# Altium schematic sheet Power_Pos.SchDoc
size A4; CompanyName: TH Nürnberg; Address1: Kesslerplatz 12; Address2: 90489 Nürnberg; Address3: GERMANY; SheetNumber: 6; SheetTotal: 10
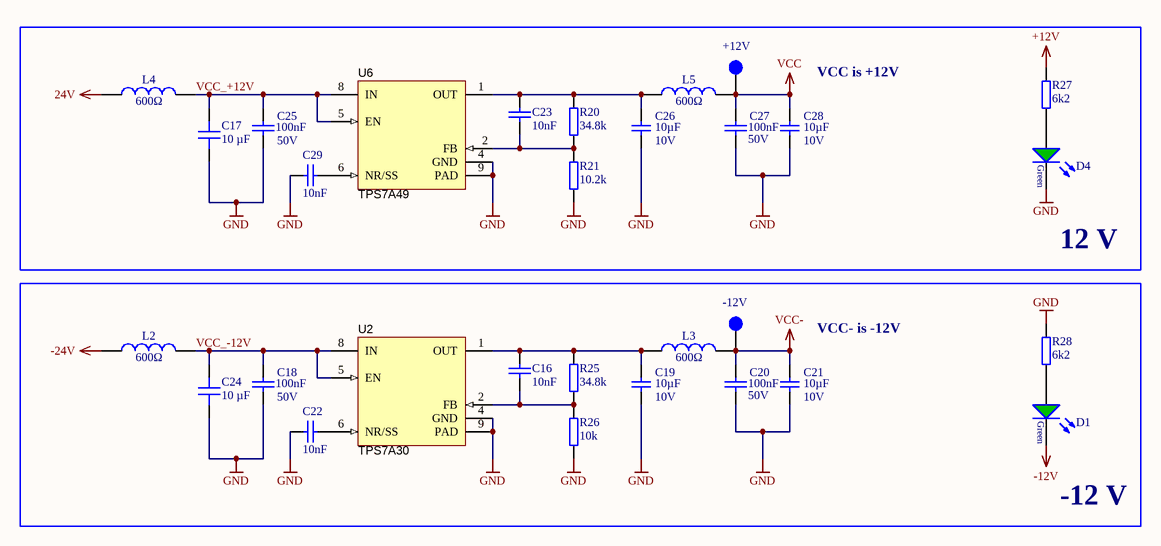
[diagram p0: Power_Pos.SchDoc]

## Parts
+12V  VCC  [TP_1mm]  (value not drawn)  (no BOM)
-12V  VCC  [TP_1mm]  (value not drawn)  (no BOM)
C16  10nF  [CAPC1608X07N]
C17  10 µF  [C_1206]
C18  100nF  Voltage: 50V  [CAPC1608X07N]
C19  10µF  Voltage: 10V  [C_1206]
C20  100nF  Voltage: 50V  [CAPC1608X07N]
C21  10µF  Voltage: 10V  [C_1206]
C22  10nF  [CAPC1608X07N]
C23  10nF  [CAPC1608X07N]
C24  10 µF  [C_1206]
C25  100nF  Voltage: 50V  [CAPC1608X07N]
C26  10µF  Voltage: 10V  [C_1206]
C27  100nF  Voltage: 50V  [CAPC1608X07N]
C28  10µF  Voltage: 10V  [C_1206]
C29  10nF  [CAPC1608X07N]
D1  150060GS75000  [WL-SMCW_0603]  (value not drawn)
D4  150060GS75000  [WL-SMCW_0603]  (value not drawn)
L2  600Ω  [WE-CBF_0805_High Current]
L3  600Ω  [WE-CBF_0805_High Current]
L4  600Ω  [WE-CBF_0805_High Current]
L5  600Ω  [WE-CBF_0805_High Current]
R20  34.8k  [RESC1608X06N]
R21  10.2k  [RESC1608X06N]
R25  34.8k  [RESC1608X06N]
R26  10k  [RESC1608X06N]
R27  6k2  [RES 0603_1608]
R28  6k2  [RES 0603_1608]
U2  TPS7A30  [DGN0008D_N]
U6  TPS7A49  [DGN0008D_N]

## Blocks framed on the sheet
12 V: +12V C17 C23 C25-C29 D4 L4 L5 R20 R21 R27 U6
-12 V: -12V C16 C18-C22 C24 D1 L2 L3 R25 R26 R28 U2

## Nets
24V: L4.1
+12V: R27.2
-12V: D1.1(K)
-24V: L2.1
GND: C17.1 C18.2 C19.1 C20.1 C21.1 C22.2 C24.1 C25.2 C26.1 C27.1 C28.1 C29.2 D4.1(K) R21.2 R26.2 R28.2 U2.4(GND) U2.9(PAD) U6.4(GND) U6.9(PAD)
VCC: +12V.1 C27.2 C28.2 L5.2
VCC-: -12V.1 C20.2 C21.2 L3.2
VCC_+12V: C17.2 C25.1 L4.2 U6.5(EN) U6.8(IN)
VCC_-12V: C18.1 C24.2 L2.2 U2.5(EN) U2.8(IN)
NetC16_1: C16.1 C19.2 L3.1 R25.1 U2.1(OUT)
NetC16_2: C16.2 R25.2 R26.1 U2.2(FB)
NetC22_1: C22.1 U2.6(NR/SS)
NetC23_1: C23.1 C26.2 L5.1 R20.1 U6.1(OUT)
NetC23_2: C23.2 R20.2 R21.1 U6.2(FB)
NetC29_1: C29.1 U6.6(NR/SS)
NetD1_2: D1.2(A) R28.1
NetD4_2: D4.2(A) R27.1

Not connected (* = marked no-connect by the designer): U2 3(NC) 7(DNC); U6 3(NC) 7(DNC)

## Notes on the sheet
- (near C28) VCC is +12V
- (near C21) VCC- is -12V
- Title
- Size:
- Date:
- A4
- Revision:
- Time:
- Sheet
- of
- Author:
- Project:

## Library data of the parts
+12V -12V = TP_1mm: Testpoint 1mm; Created: 2018_06_25_AGeiger; Value: Testpoint 1mm
C16 C22 C23 C29 = Cap_0603: MPN: 885012206065; MF: Würth Elektronik; Voltage: 25V; Dielectric: X7R; Value: 10nF; Supplier 1: Mouser; Supplier 2: Digi-Key; Supplier Part Number 1: 710-885012206065; Supplier Part Number 2: 732-7983-1-ND; Package: 0603
C17 C24 = CGA5L1X7R1H106K160AC: Capacitor 1206, 50 VDC, 10 µF, X7R; Manufacturer: TDK; Tolerance: 10 %; Voltage Rating: 50 VDC; Created from: MGremer; Manufacturer Part Number: CGA5L1X7R1H106K160AC; PartID: 25; Created On: 20.12.2020 13:54:13; ComponentLink1Description: Datasheet; ComponentLink1URL: https://product.tdk.com/info/en/catalog/datasheets/mlcc_automotive_general_en.pdf; Component Type: Capacitor 1206; Device Package: 1206; Last Updated: 20.12.2020 16:34:30; Mounting Type: SMD; Operating Temperature: -55 - 125°C; Series: CGA; Supplier 1: Mouser; Supplier Part Number 1: 810-CGA5L1X7R1H106K1; Type: Capacitor; Value: 10 µF; Live Cycle Status: 1; Stock number: Labor SMD Container
C18 C20 C25 C27 = Cap_0603: MPN: CC0603KRX7R9BB104; MF: Yageo; Tolerance: 10%; Dielectric: X5R; Value: 100nF; Supplier 1: Mouser; Supplier 2: Mouser; Supplier Part Number 1: 603-CC603KRX7R9BB104; Supplier Part Number 2: 710-885382206004; Package: 0603
C19 C21 C26 C28 = C_1206: Capacitor 1206; MPN: CL31A106KPHNNNE; Tolerance: 10%; MF: Samsung Electro-Mechanics; Dielectric: X5R; Package: 1206; Value: 10µF; Created: 2020_09_17_Liegmann; Supplier 1: Mouser; Supplier Part Number 1: 187-CL31A106KPHNNNE
D1 D4 = LED_Green_0603: WL-SMCW SMD Mono-color Chip LED Waterclear, size 0603, Green, 3.2 V, 140°; Forward Voltage: 3.2 V; Luminous Intensity: 430 mcd; Peak Wavelength: 515 nm; Dominant Wavelength: 520 nm; MF: Wuerth Elektronik; Published Date: Sep. 2017; ComponentLink1Description: Manufacturer; ComponentLink1URL: http://www.we-online.de; ComponentLink2Description: Datasheet; ComponentLink2URL: http://katalog.we-online.com/led/datasheet/150060GS75000.pdf; MPN: 150060GS75000; Size: 0603; Viewing Angle: 140°; Emitting Color: Green; Value: 150060GS75000; Package: 0603; Created: 2018_09_06_AGeiger; Supplier 1: Farnell; Supplier Part Number 1: 2322070; Supplier 2: Mouser; Supplier Part Number 2: 710-150060GS75000; Supplier 3: Digi-Key; Supplier Part Number 3: 732-4971-1-ND
L2-L5 = WE-CBF, 742792040: WE-CBF SMD EMI Suppression Ferrite Bead, 0805, 600Ω; MF: Würth Elektronik; Type: High Current; ComponentLink1Description: Manufacturer; ComponentLink1URL: http://www.we-online.de; ComponentLink2Description: Datasheet; ComponentLink2URL: http://katalog.we-online.de/pbs/datasheet/742792040.pdf; MPN: 742792040; Value: 600Ω; Size: 0805; Supplier 1: Farnell; Supplier 2: Mouser; Supplier 3: Digi-Key; Supplier Part Number 1: 1635735; Supplier Part Number 2: 710-742792040; Supplier Part Number 3: 732-1620-1-ND
R20 R25 = R_0603: MPN: CR0603-FX-3482ELF; MF: Bourns; Tolerance: 1%; Value: 34.8k; Supplier 1: Mouser; Supplier Part Number 1: 652-CR0603FX-3482ELF; Package: 0603
R21 = R_0603: MPN: CR0603-FX-1022ELF; MF: Bourns; Tolerance: 1%; Value: 10.2k; Supplier 1: Mouser; Supplier Part Number 1: 652-CR0603FX-1022ELF; Package: 0603
R26 = R_0603: MPN: CR0603-FX-1002ELF; MF: Bourns; Tolerance: 1%; Value: 10k; Supplier 1: Mouser; Supplier Part Number 1: 652-CR0603FX-1002ELF; Package: 0603
R27 R28 = RK73B1JTTD622J: SMD resistor E24 series; Manufacturer: KOA Speer; Tolerance: 5%; Created from: MGremer; Manufacturer Part Number: RK73B1JTTD622J; PartID: 93; Created On: 14.12.2020 16:17:14; ComponentLink1Description: Datasheet; ComponentLink1URL: https://www.mouser.de/datasheet/2/219/RK73B-1825463.pdf; Component Type: SMD resistor; Device Package: 0603; Last Updated: 02.03.2021 14:07:32; Mounting Type: SMD; Supplier 1: Mouser; Supplier Part Number 1: 660-RK73B1JTTD622J; Type: Resistor; Value: 6k2; Live Cycle Status: 1; Stock number: Labor SMD Container
U2 = TPS7A3001DGN: -36V, -200mA, Ultralow-Noise, High PSRR, Adjustable -1.18 to -33 V Output, Negative Linear Regulator, 8-pin MSOP (DGN), -40 to 125 degC, Green (RoHS & no Sb/Br); MF: Texas Instruments; Parameter 1: Farnell; PackageReference: DGN0008D; PackageDescription: 8-pin Plastic Small Outline, Body 3 x 3 mm, Pitch 0.65 mm; Supplier 1: Digi-Key; Supplier Part Number 1: 296-27750-1-ND; MPN: TPS7A3001DGN; ComponentLink1Description: Manufacturer URL; ComponentLink1URL: http://www.ti.com/; ComponentLink2Description: Datasheet; ComponentLink2URL: http://www.ti.com/general/docs/lit/getliterature.tsp?genericPartNumber=TPS7A3001&fileType=pdf; ComponentLink3Description: Package Specification; ComponentLink3URL: http://www.ti.com/litv/pdf/mpds046e; Supplier 2: Mouser; Supplier Part Number 2: 595-TPS7A3001DGNT; Supplier Part Number 3: 3122632
U6 = TPS7A4901DGN: +36V, +150mA, Ultralow-Noise, Positive LINEAR REGULATOR, DGN0008D; CompType: IC; MF: Texas Instruments; MPN: TPS7A4901DGN; PackageReference: DGN0008D; MountType: SMT; ComponentLink1Description: Datasheet Link; ComponentLink1URL: http://www.ti.com/lit/ds/symlink/tps7a4901.pdf; Supplier 1: Digi-Key; Supplier Part Number 1: 296-27751-6-ND; Supplier 2: Mouser; Supplier Part Number 2: 595-TPS7A4901DGNR; Supplier 3: Fanell; Supplier Part Number 3: 3008004